# EAGLE schematic piskac_pan (EAGLE 7.2.0)
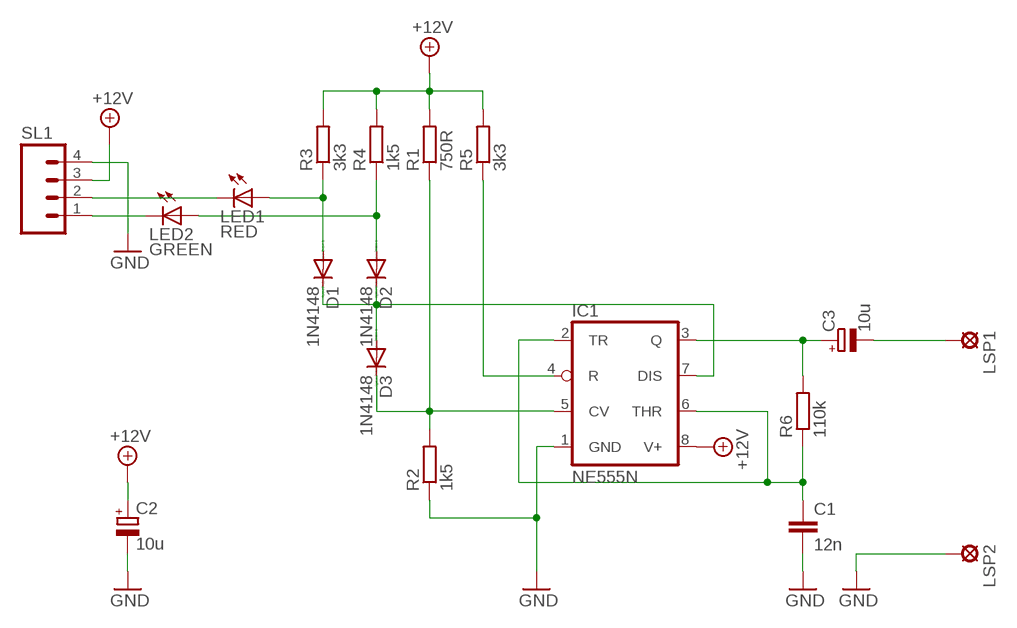
[diagram p0: schematic, sheet 1]

## Parts
C1  12n  C5/3.5  [C5B3.5]
C2  10u  CPOL-EUE2.5-6  [E2,5-6]
C3  10u  CPOL-EUE2.5-6  [E2,5-6]
D1  1N4148  DIODE-DO35-10  [DO35-10]
D2  1N4148  DIODE-DO35-10  [DO35-10]
D3  1N4148  DIODE-DO35-10  [DO35-10]
IC1  NE555N  [DIL08]
LED1  RED  LED3MM  [LED3MM]
LED2  GREEN  LED3MM  [LED3MM]
LSP1  LSP10  [LSP10]
LSP2  LSP10  [LSP10]
R1  750R  R-EU_0207/10  [0207/10]
R2  1k5  R-EU_0207/10  [0207/10]
R3  3k3  R-EU_0207/10  [0207/10]
R4  1k5  R-EU_0207/10  [0207/10]
R5  3k3  R-EU_0207/10  [0207/10]
R6  110k  R-EU_0207/10  [0207/10]
SL1  M04  [04P]

## Nets
+12V: C2.+ IC1.8(V+) R1.2 R3.2 R4.2 R5.2 SL1.3
GND: C1.2 C2.- IC1.1(GND) LSP2.MP R2.1 SL1.4
N$1: C1.1 IC1.2(TR) IC1.6(THR) R6.1
N$2: D3.C IC1.5(CV) R1.1 R2.2
N$3: C3.- LSP1.MP
N$4: IC1.4(R) R5.1
N$5: D1.A LED1.A R3.1
N$6: LED1.K(C) SL1.2
N$7: D2.A LED2.A R4.1
N$8: C3.+ IC1.3(Q) R6.2
N$9: D1.C D2.C D3.A IC1.7(DIS)
N$11: LED2.K(C) SL1.1

## Library data of the parts
C1 = capacitor-wima:C: CAPACITOR naming: grid - package width
C2 C3 = rcl:CPOL-EU: POLARIZED CAPACITOR, European symbol
D1-D3 = diode:DIODE-: DIODE
IC1 = linear:*555: TIMER
LED1 LED2 = led:LED: LED OSRAM: - CHIPLED LG R971, LG N971, LY N971, LG Q971, LY Q971, LO R971, LY R971 LH N974, LH R974 LS Q976, LO Q976, LY Q976 LO Q996 - Hyper CHIPLED LW Q18S LB Q993, LB Q99A, LB R99A - SideLED LS A670, LO A670, LY A670, LG A670, LP A670 LB A673, LV A673, LT A673, LW A673 LH A674 LY A675 LS A676, LA A676, LO A676, LY A676, LW A676 LS A679, LY A679, LG A679 - Hyper Micro SIDELED® LS Y876, LA Y876, LO Y876, LY Y876 LT Y87S - SmartLED LW L88C, LW L88S LB L89C, LB L89S, LG L890 LS L89K, LO L89K, LY L89K LS L896, LA L896, LO L896, LY L896 - TOPLED LS T670, LO T670, LY T670, LG T670, LP T670 LSG T670, LSP T670, LSY T670, LOP T670, LYG T670 LG T671, LOG T671, LSG T671 LB T673, LV T673, LT T673, LW T673 LH T674 LS T676, LA T676, LO T676, LY T676, LB T676, LH T676, LSB T676, LW T676 LB T67C, LV T67C, LT T67C, LS T67K, LO T67K, LY T67K, LW E67C LS E67B, LA E67B, LO E67B, LY E67B, LB E67C, LV E67C, LT E67C LW T67C LS T679, LY T679, LG T679 LS T770, LO T770, LY T770, LG T770, LP T770 LB T773, LV T773, LT T773, LW T773 LH T774 LS E675, LA E675, LY E675, LS T675 LS T776, LA T776, LO T776, LY T776, LB T776 LHGB T686 LT T68C, LB T68C - Hyper Mini TOPLED® LB M676 - Mini TOPLED Santana® LG M470 LS M47K, LO M47K, LY M47K Source: http://www.osram.convergy.de LUXEON: - LUMILED® LXK2-PW12-R00, LXK2-PW12-S00, LXK2-PW14-U00, LXK2-PW14-V00 LXK2-PM12-R00, LXK2-PM12-S00, LXK2-PM14-U00 LXK2-PE12-Q00, LXK2-PE12-R00, LXK2-PE12-S00, LXK2-PE14-T00, LXK2-PE14-U00 LXK2-PB12-K00, LXK2-PB12-L00, LXK2-PB12-M00, LXK2-PB14-N00, LXK2-PB14-P00, LXK2-PB14-Q00 LXK2-PR12-L00, LXK2-PR12-M00, LXK2-PR14-Q00, LXK2-PR14-R00 LXK2-PD12-Q00, LXK2-PD12-R00, LXK2-PD12-S00 LXK2-PH12-R00, LXK2-PH12-S00 LXK2-PL12-P00, LXK2-PL12-Q00, LXK2-PL12-R00 Source: www.luxeon.com KINGBRIGHT: KA-3528ASYC Source: www.kingbright.com
LSP1 LSP2 = solpad:LSP10: SOLDER PAD drill 1.0 mm, distributor Buerklin, 12H555
R1-R6 = rcl:R-EU_: RESISTOR, European symbol
SL1 = con-amp-quick:M04: AMP QUICK CONNECTOR; OC_FARNELL: unknown; OC_NEWARK: unknown